# EAGLE design SideSensor_PCB_v4 (EAGLE 9.7.0)
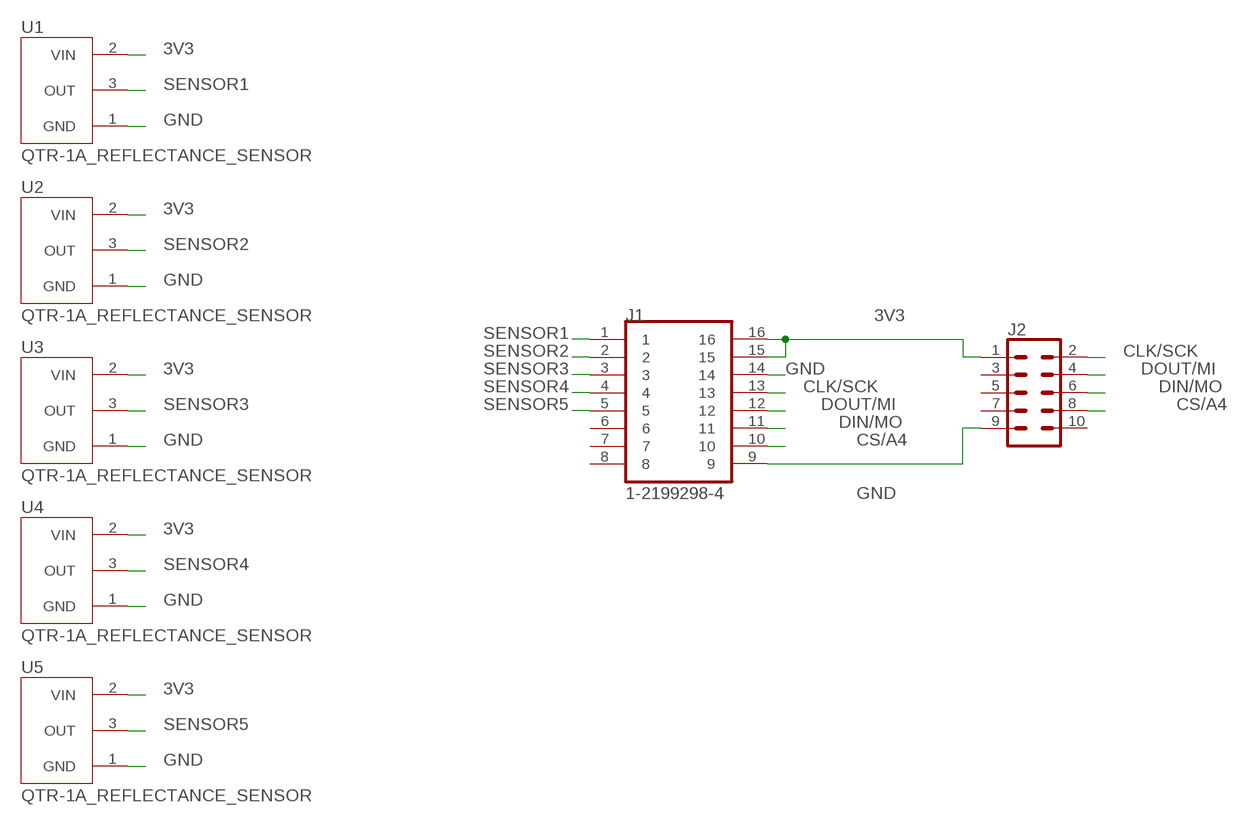
[diagram p0: schematic, sheet 1]

## Parts
J1  1-2199298-4  [TE_1-2199298-4]
J2  CONN_05X2PTH  [2X5]
U1  QTR-1A_REFLECTANCE_SENSOR  [SENSOR_QTR-1A_REFLECTANCE_SENSOR]
U2  QTR-1A_REFLECTANCE_SENSOR  [SENSOR_QTR-1A_REFLECTANCE_SENSOR]
U3  QTR-1A_REFLECTANCE_SENSOR  [SENSOR_QTR-1A_REFLECTANCE_SENSOR]
U4  QTR-1A_REFLECTANCE_SENSOR  [SENSOR_QTR-1A_REFLECTANCE_SENSOR]
U5  QTR-1A_REFLECTANCE_SENSOR  [SENSOR_QTR-1A_REFLECTANCE_SENSOR]

## Nets
3V3: J1.15 J1.16 J2.1 U1.2(VIN) U2.2(VIN) U3.2(VIN) U4.2(VIN) U5.2(VIN)
CLK/SCK: J1.13 J2.2
CS/A4: J1.10 J2.8
DIN/MO: J1.11 J2.6
DOUT/MI: J1.12 J2.4
GND: J1.9 J1.14 J2.9 U1.1(GND) U2.1(GND) U3.1(GND) U4.1(GND) U5.1(GND)
SENSOR1: J1.1 U1.3(OUT)
SENSOR2: J1.2 U2.3(OUT)
SENSOR3: J1.3 U3.3(OUT)
SENSOR4: J1.4 U4.3(OUT)
SENSOR5: J1.5 U5.3(OUT)
Unconnected: J1.6 J1.7 J1.8 J2.3 J2.5 J2.7 J2.10

## Library data of the parts
J1 = 16 pin IC Socket:1-2199298-4; MANUFACTURER: TE; PARTREV: A; STANDARD: Manufacturer Recommendations
J2 = SparkFun-Connectors:CONN_05X2: Multi connection point. Often used as Generic Header-pin footprint for 0.1 inch spaced/style header connections For AVR SPI programming port, see special device with nice symbol: "AVR_SPI_PROG_5x2.dev" You can populate with any combo of single row headers, but if you'd like an exact match, check these: 2x5 AVR ICSP Male Header <https://www.sparkfun.com/products/778> (PRT-00778) 2x5 Pin Shrouded Header <https://www.sparkfun.com/products/8506> (PRT-08506) On any of the 0.1 inch spaced packages, you can populate with these: Break Away Headers - Straight <https://www.sparkfun.com/products/116> (PRT-00116) Break Away Male Headers - Right Angle <https://www.sparkfun.com/products/553> (PRT-00553) Female Headers <https://www.sparkfun.com/products/115> (PRT-00115) Break Away Headers - Machine Pin <https://www.sparkfun.com/products/117> (PRT-00117) Break Away Female Headers - Swiss Machine Pin <https://www.sparkfun.com/products/743> (PRT-00743) Special note: the shrouded connector mates well with our 5x2 ribbon cables: 2x5 Pin IDC Ribbon Cable <https://www.sparkfun.com/products/8535> (PRT-08535); PROD_ID: CONN-08499; SF_ID: PRT-0778
U1-U5 = QTR-1A_REFLECTANCE_SENSOR:QTR-1A_REFLECTANCE_SENSOR: Check availability <https://pricing.snapeda.com/parts/QTR-1A%20REFLECTANCE%20SENSOR/Pololu/view-part?ref=eda>; AVAILABILITY: Not in stock; CHECK_PRICES: https://www.snapeda.com/parts/QTR-1A%20REFLECTANCE%20SENSOR/Pololu/view-part/?ref=eda; DESCRIPTION: QTR-1A series Phototransistor Sensor Evaluation Board; MF: Pololu; MP: QTR-1A REFLECTANCE SENSOR; PACKAGE: None; PRICE: None; SNAPEDA_LINK: https://www.snapeda.com/parts/QTR-1A%20REFLECTANCE%20SENSOR/Pololu/view-part/?ref=snap

## Board
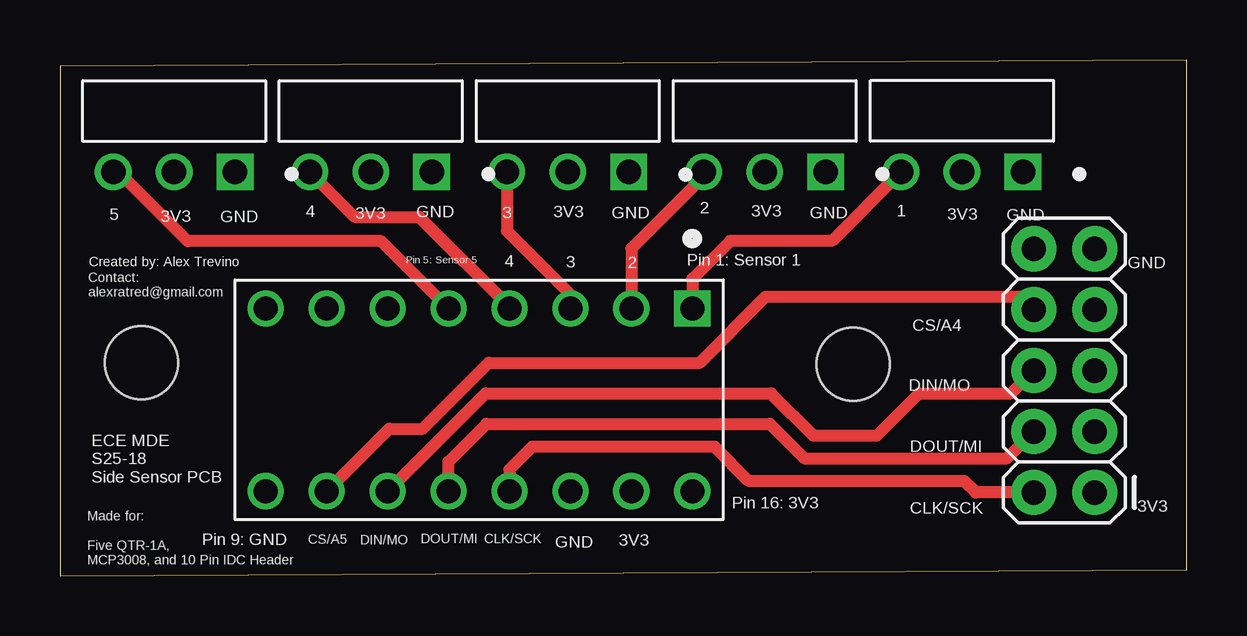
[diagram p1: board, top side]
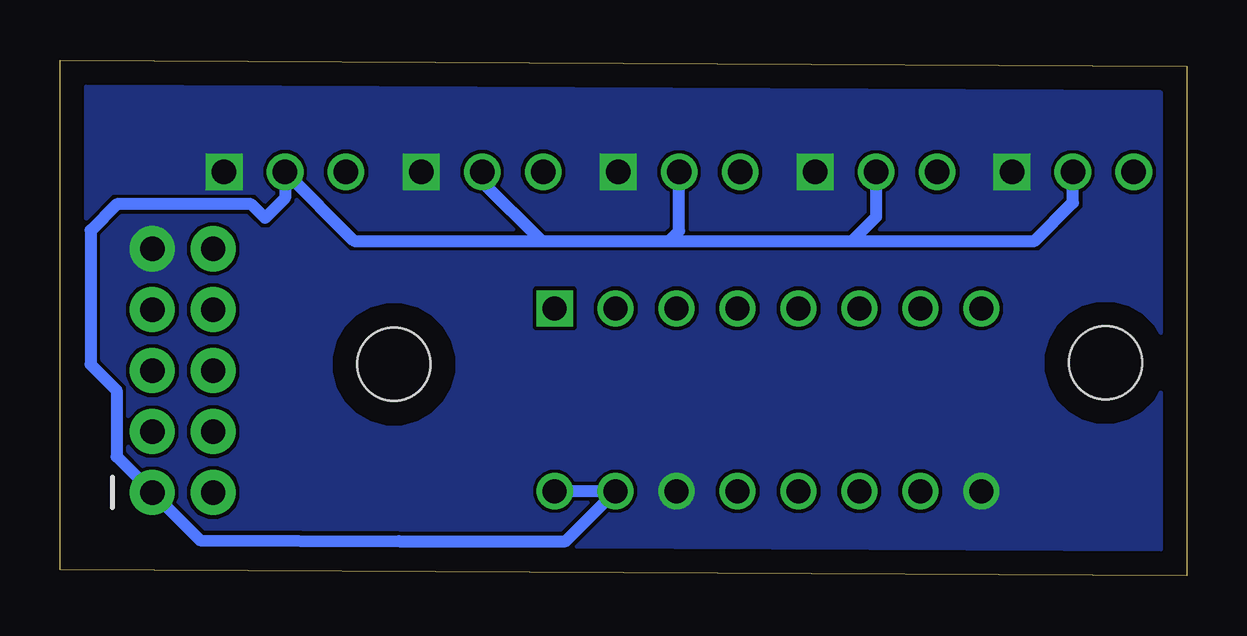
[diagram p2: board, bottom side, seen from below]

Size 46.98 x 21.52 mm. Coordinates in mm from the lower left corner, seen from the top.
Outline: 0,0 46.98,0.26 46.98,21.52 0,21.26 0,0
Copper layers (1*16): Top / Bottom
Stack-up Default Layer Stack: Top User Defined 0.035mm / Dielectric-1 User Defined 1.5mm / Bottom User Defined 0.035mm
Design rules: minimum copper width 6mil, minimum drill size 0.35mm, copper clearance wire_polygon to wire_polygon 6mil, copper clearance wire_polygon to pad_smd 6mil, copper clearance wire_polygon to via 6mil, copper clearance pad_smd to pad_smd 6mil, copper clearance pad_smd to via 6mil, copper clearance via to via 6mil, copper clearance smd to pad (same net) 6mil, copper clearance smd to via (same net) 6mil, copper clearance smd to smd (same net) 6mil, dimension clearance 40mil, via restrict clearance 0mil, restrict clearance 0mil, drill distance 6mil, keepout clearance 0mil
Holes 3.05 mm at 33.06,8.83 3.4,8.89

### Footprints (pad centres in the part's own frame; a part is rotated, then mirrored left to right if it is on the bottom)
TE_1-2199298-4 = drill 1 square: 1 -3.81,8.89 | drill 1: 2 -3.81,6.35; 3 -3.81,3.81; 4 -3.81,1.27; 5 -3.81,-1.27; 6 -3.81,-3.81; 7 -3.81,-6.35; 8 -3.81,-8.89; 9 3.81,-8.89; 10 3.81,-6.35; 11 3.81,-3.81; 12 3.81,-1.27; 13 3.81,1.27; 14 3.81,3.81; 15 3.81,6.35; 16 3.81,8.89
2X5 = drill 1.016 pad 1.88: 1 0,0; 2 0,2.54; 3 2.54,0; 4 2.54,2.54; 5 5.08,0; 6 5.08,2.54; 7 7.62,0; 8 7.62,2.54; 9 10.16,0; 10 10.16,2.54
SENSOR_QTR-1A_REFLECTANCE_SENSOR = drill 1.02 square: 1 -2.54,2.54 | drill 1.02: 2 0,2.54; 3 2.54,2.54

### Placement (x,y rotation side)
J1  17.47,7.35 270 top
J2  43.13,3.48 90 top
U1  37.6,19.39 180 top
U2  29.38,19.39 180 top
U3  21.17,19.39 180 top
U4  12.95,19.39 180 top
U5  4.76,19.39 180 top

### Tracks (layer width: path | path; a pad name or v marks a point on that pad's centre or on a via)
3V3
  Bottom 0.508: 26.91,13.97 34.71,13.97 U1.2 37.6,15.76 38.43,14.93 39.01,15.5 44.6,15.5 45.7,14.41 45.7,8.83 44.62,7.74 44.62,4.98 43.13,3.5 J2.1 41.14,1.5 32.85,1.45 25.9,1.45 J1.15 J1.16 | 26.91,13.97 21.59,13.97 | 21.59,13.97 21.17,14.39 U3.2 | 21.59,13.97 13.97,13.97 | 13.97,13.97 12.95,14.99 U4.2 | 13.97,13.97 6.35,13.97 4.76,15.56 U5.2 | 26.91,13.97 29.38,16.43 U2.2
CLK/SCK
  Top 0.508: J2.2 38.17,3.48 37.71,3.95 28.72,3.95 27.29,5.38 27.29,5.39 19.68,5.39 18.74,4.44 J1.13
CS/A4
  Top 0.508: J1.10 13.72,6.14 15.12,6.14 17.88,8.89 26.67,8.89 29.43,11.64 40.05,11.64 J2.8
DIN/MO
  Top 0.508: J1.11 17.74,7.62 29.64,7.62 31.4,5.86 34.04,5.86 35.8,7.62 39.65,7.62 J2.6
DOUT/MI
  Top 0.508: J1.12 16.2,4.77 17.78,6.35 29.58,6.35 31.02,4.91 39.48,4.91 J2.4
GND
  pour Bottom (no thermals): 0.41,21.17 47.19,21.17 47.19,-0.59 1.38,-0.59 -0.86,19.9 -0.86,19.9
SENSOR1
  Top 0.508: U1.3 32.17,13.97 27.94,13.97 26.36,12.39 J1.1
SENSOR2
  Top 0.508: U2.3 26.84,16.68 23.82,13.66 J1.2
SENSOR3
  Top 0.508: U3.3 18.63,14.39 21.28,11.74 J1.3
SENSOR4
  Top 0.508: U4.3 12.29,14.98 14.99,14.98 18.74,11.23 J1.4
SENSOR5
  Top 0.508: U5.3 2.44,16.85 5.33,13.96 13.39,13.96 J1.5

### Text on the board
SilkscreenTop: 5 | 3V3 | GND | 4 | 3V3 | GND | 3 | 3V3 | GND | 2 | 3V3 | GND | 1 | 3V3 | GND | Created by: Alex Trevino | Pin 5: Sensor 5 | 4 | 3 | 2 | Pin 1: Sensor 1 | GND | Contact: / alexratred@gmail.com | CS/A4 | DIN/MO | DOUT/MI | ECE MDE / S25-18 / Side Sensor PCB | Pin 16: 3V3 | CLK/SCK | 3V3 | Pin 9: GND | CS/A5 | DIN/MO | DOUT/MI | CLK/SCK | 3V3 | Made for: / / Five QTR-1A, / MCP3008, and 10 Pin IDC Header | GND